# EAGLE design pcb (EAGLE 5.04)
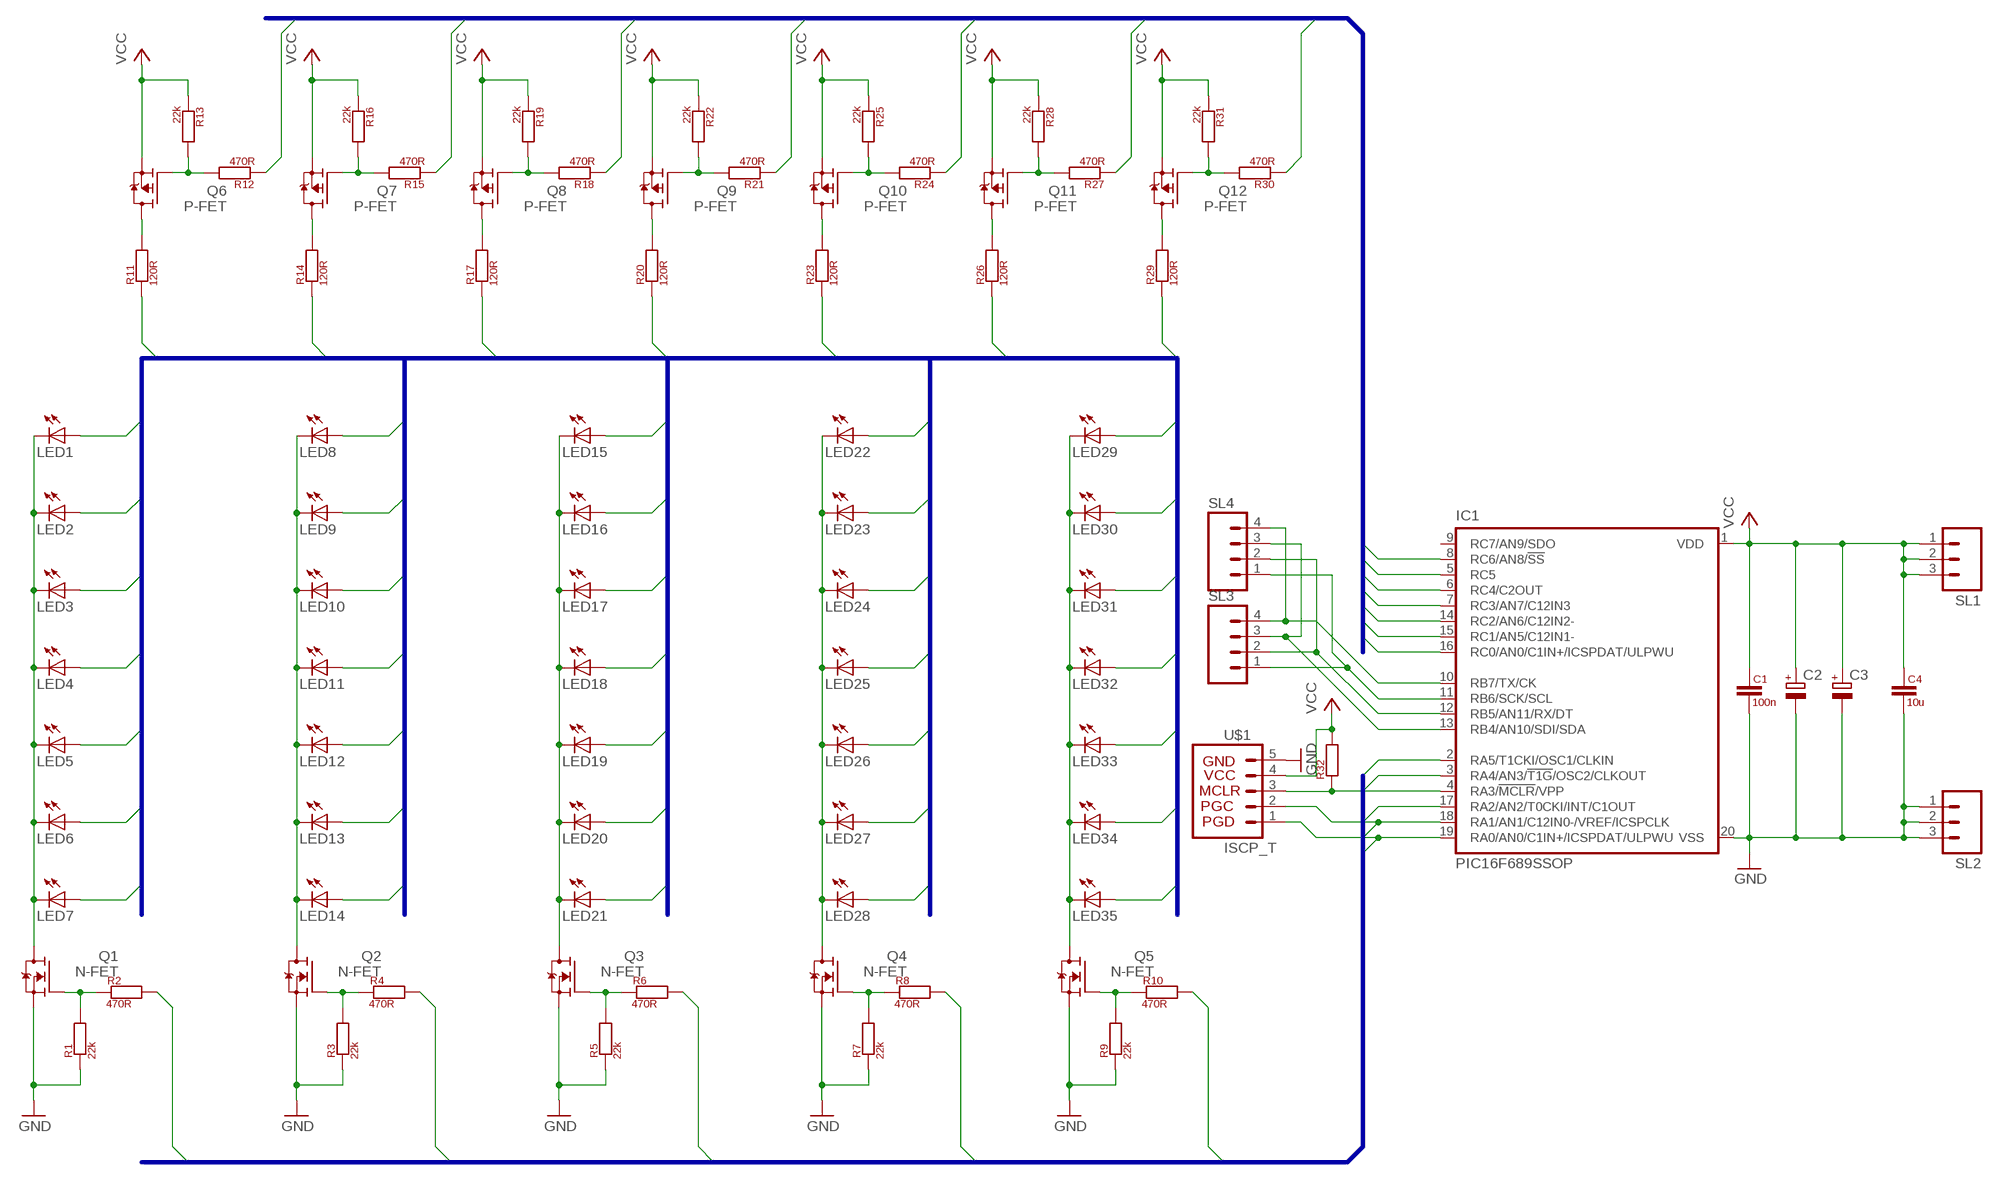
[diagram p0: schematic, sheet 1]

## Parts
C1  100n  CAP0805  [SMD_0805]
C2  CPOL-EUE2.5-7  [E2,5-7]
C3  CPOL-EUE2.5-7  [E2,5-7]
C4  10u  CAP0805  [SMD_0805]
IC1  PIC16F689SSOP  [SSOP20]
LED1  LED10MM  [LED10MM]
LED2  LED10MM  [LED10MM]
LED3  LED10MM  [LED10MM]
LED4  LED10MM  [LED10MM]
LED5  LED10MM  [LED10MM]
LED6  LED10MM  [LED10MM]
LED7  LED10MM  [LED10MM]
LED8  LED10MM  [LED10MM]
LED9  LED10MM  [LED10MM]
LED10  LED10MM  [LED10MM]
LED11  LED10MM  [LED10MM]
LED12  LED10MM  [LED10MM]
LED13  LED10MM  [LED10MM]
LED14  LED10MM  [LED10MM]
LED15  LED10MM  [LED10MM]
LED16  LED10MM  [LED10MM]
LED17  LED10MM  [LED10MM]
LED18  LED10MM  [LED10MM]
LED19  LED10MM  [LED10MM]
LED20  LED10MM  [LED10MM]
LED21  LED10MM  [LED10MM]
LED22  LED10MM  [LED10MM]
LED23  LED10MM  [LED10MM]
LED24  LED10MM  [LED10MM]
LED25  LED10MM  [LED10MM]
LED26  LED10MM  [LED10MM]
LED27  LED10MM  [LED10MM]
LED28  LED10MM  [LED10MM]
LED29  LED10MM  [LED10MM]
LED30  LED10MM  [LED10MM]
LED31  LED10MM  [LED10MM]
LED32  LED10MM  [LED10MM]
LED33  LED10MM  [LED10MM]
LED34  LED10MM  [LED10MM]
LED35  LED10MM  [LED10MM]
Q1  N-FET  IRLML2502VELIKIPADI  [SOT23]
Q2  N-FET  IRLML2502VELIKIPADI  [SOT23]
Q3  N-FET  IRLML2502VELIKIPADI  [SOT23]
Q4  N-FET  IRLML2502VELIKIPADI  [SOT23]
Q5  N-FET  IRLML2502VELIKIPADI  [SOT23]
Q6  P-FET  IRLML5203VELIKIPADI  [SOT23]
Q7  P-FET  IRLML5203VELIKIPADI  [SOT23]
Q8  P-FET  IRLML5203VELIKIPADI  [SOT23]
Q9  P-FET  IRLML5203VELIKIPADI  [SOT23]
Q10  P-FET  IRLML5203VELIKIPADI  [SOT23]
Q11  P-FET  IRLML5203VELIKIPADI  [SOT23]
Q12  P-FET  IRLML5203VELIKIPADI  [SOT23]
R1  22k  UPOR0805  [SMD_0805]
R2  470R  UPOR0805  [SMD_0805]
R3  22k  UPOR0805  [SMD_0805]
R4  470R  UPOR0805  [SMD_0805]
R5  22k  UPOR0805  [SMD_0805]
R6  470R  UPOR0805  [SMD_0805]
R7  22k  UPOR0805  [SMD_0805]
R8  470R  UPOR0805  [SMD_0805]
R9  22k  UPOR0805  [SMD_0805]
R10  470R  UPOR0805  [SMD_0805]
R11  120R  UPOR0805  [SMD_0805]
R12  470R  UPOR0805  [SMD_0805]
R13  22k  UPOR0805  [SMD_0805]
R14  120R  UPOR0805  [SMD_0805]
R15  470R  UPOR0805  [SMD_0805]
R16  22k  UPOR0805  [SMD_0805]
R17  120R  UPOR0805  [SMD_0805]
R18  470R  UPOR0805  [SMD_0805]
R19  22k  UPOR0805  [SMD_0805]
R20  120R  UPOR0805  [SMD_0805]
R21  470R  UPOR0805  [SMD_0805]
R22  22k  UPOR0805  [SMD_0805]
R23  120R  UPOR0805  [SMD_0805]
R24  470R  UPOR0805  [SMD_0805]
R25  22k  UPOR0805  [SMD_0805]
R26  120R  UPOR0805  [SMD_0805]
R27  470R  UPOR0805  [SMD_0805]
R28  22k  UPOR0805  [SMD_0805]
R29  120R  UPOR0805  [SMD_0805]
R30  470R  UPOR0805  [SMD_0805]
R31  22k  UPOR0805  [SMD_0805]
R32  UPOR0805  [SMD_0805]
SL1  M03  [03P]
SL2  M03  [03P]
SL3  M04  [04P]
SL4  M04  [04P]
U$1  ISCP_T  [ISCP_T]

## Nets
GND: C1.P$2 C2.- C3.- C4.P$2 IC1.20(VSS) Q1.2(S) Q2.2(S) Q3.2(S) Q4.2(S) Q5.2(S) R1.P$1 R3.P$1 R5.P$1 R7.P$1 R9.P$1 SL2.1 SL2.2 SL2.3 U$1.5
K1: IC1.19(RA0/AN0/C1IN+/ICSPDAT/ULPWU) R2.P$2 U$1.1
K2: IC1.18(RA1/AN1/C12IN0-/VREF/ICSPCLK) R4.P$2 U$1.2
K3: IC1.17(RA2/AN2/T0CKI/INT/C1OUT) R6.P$2
K4: IC1.3(RA4/AN3/!T1G!/OSC2/CLKOUT) R8.P$2
K5: IC1.2(RA5/T1CKI/OSC1/CLKIN) R10.P$2
LED1: LED1.A LED8.A LED15.A LED22.A LED29.A R11.P$1
LED2: LED2.A LED9.A LED16.A LED23.A LED30.A R14.P$1
LED3: LED3.A LED10.A LED17.A LED24.A LED31.A R17.P$1
LED4: LED4.A LED11.A LED18.A LED25.A LED32.A R20.P$1
LED5: LED5.A LED12.A LED19.A LED26.A LED33.A R23.P$1
LED6: LED6.A LED13.A LED20.A LED27.A LED34.A R26.P$1
LED7: LED7.A LED14.A LED21.A LED28.A LED35.A R29.P$1
N$1: LED1.K(C) LED2.K(C) LED3.K(C) LED4.K(C) LED5.K(C) LED6.K(C) LED7.K(C) Q1.3(D)
N$2: Q1.1(G) R1.P$2 R2.P$1
N$3: LED8.K(C) LED9.K(C) LED10.K(C) LED11.K(C) LED12.K(C) LED13.K(C) LED14.K(C) Q2.3(D)
N$4: Q2.1(G) R3.P$2 R4.P$1
N$5: LED15.K(C) LED16.K(C) LED17.K(C) LED18.K(C) LED19.K(C) LED20.K(C) LED21.K(C) Q3.3(D)
N$6: Q3.1(G) R5.P$2 R6.P$1
N$7: LED22.K(C) LED23.K(C) LED24.K(C) LED25.K(C) LED26.K(C) LED27.K(C) LED28.K(C) Q4.3(D)
N$8: Q4.1(G) R7.P$2 R8.P$1
N$9: LED29.K(C) LED30.K(C) LED31.K(C) LED32.K(C) LED33.K(C) LED34.K(C) LED35.K(C) Q5.3(D)
N$10: Q5.1(G) R9.P$2 R10.P$1
N$11: Q7.1(G) R15.P$2 R16.P$2
N$12: Q6.1(G) R12.P$2 R13.P$2
N$13: Q6.3(D) R11.P$2
N$14: Q7.3(D) R14.P$2
N$15: Q8.1(G) R18.P$2 R19.P$2
N$16: Q8.3(D) R17.P$2
N$17: Q9.1(G) R21.P$2 R22.P$2
N$18: Q9.3(D) R20.P$2
N$19: Q10.1(G) R24.P$2 R25.P$2
N$20: Q10.3(D) R23.P$2
N$21: Q11.1(G) R27.P$2 R28.P$2
N$22: Q11.3(D) R26.P$2
N$23: Q12.1(G) R30.P$2 R31.P$2
N$24: Q12.3(D) R29.P$2
N$25: IC1.10(RB7/TX/CK) SL3.4 SL4.4
N$26: IC1.4(RA3/!MCLR!/VPP) R32.P$1 U$1.3
N$27: IC1.11(RB6/SCK/SCL) SL3.1 SL4.1
N$28: IC1.12(RB5/AN11/RX/DT) SL3.2 SL4.2
N$29: IC1.13(RB4/AN10/SDI/SDA) SL3.3 SL4.3
RC0: IC1.16(RC0/AN0/C1IN+/ICSPDAT/ULPWU) R12.P$1
RC1: IC1.15(RC1/AN5/C12IN1-) R15.P$1
RC2: IC1.14(RC2/AN6/C12IN2-) R18.P$1
RC3: IC1.7(RC3/AN7/C12IN3) R21.P$1
RC4: IC1.6(RC4/C2OUT) R24.P$1
RC5: IC1.5(RC5) R27.P$1
RC6: IC1.8(RC6/AN8/!SS) R30.P$1
VCC: C1.P$1 C2.+ C3.+ C4.P$1 IC1.1(VDD) Q6.2(S) Q7.2(S) Q8.2(S) Q9.2(S) Q10.2(S) Q11.2(S) Q12.2(S) R13.P$1 R16.P$1 R19.P$1 R22.P$1 R25.P$1 R28.P$1 R31.P$1 R32.P$2 SL1.1 SL1.2 SL1.3 U$1.4
Unconnected: IC1.9(RC7/AN9/SDO)

## Buses
LED[1..7]
RC[0..6]
K[1..5]

## Library data of the parts
C1 C4 = ostali elementi:CAP0805
C2 C3 = resistor:CPOL-EU: POLARIZED CAPACITOR, European symbol
IC1 = microchip:PIC16F689
LED1-LED35 = led:LED: LED OSRAM: - CHIPLED LG R971, LG N971, LY N971, LG Q971, LY Q971, LO R971, LY R971 LH N974, LH R974 LS Q976, LO Q976, LY Q976 LO Q996 - Hyper CHIPLED LW Q18S LB Q993, LB Q99A, LB R99A - SideLED LS A670, LO A670, LY A670, LG A670, LP A670 LB A673, LV A673, LT A673, LW A673 LH A674 LY A675 LS A676, LA A676, LO A676, LY A676, LW A676 LS A679, LY A679, LG A679 - Hyper Micro SIDELED® LS Y876, LA Y876, LO Y876, LY Y876 LT Y87S - SmartLED LW L88C, LW L88S LB L89C, LB L89S, LG L890 LS L89K, LO L89K, LY L89K LS L896, LA L896, LO L896, LY L896 - TOPLED LS T670, LO T670, LY T670, LG T670, LP T670 LSG T670, LSP T670, LSY T670, LOP T670, LYG T670 LG T671, LOG T671, LSG T671 LB T673, LV T673, LT T673, LW T673 LH T674 LS T676, LA T676, LO T676, LY T676, LB T676, LH T676, LSB T676, LW T676 LB T67C, LV T67C, LT T67C, LS T67K, LO T67K, LY T67K, LW E67C LS E67B, LA E67B, LO E67B, LY E67B, LB E67C, LV E67C, LT E67C LW T67C LS T679, LY T679, LG T679 LS T770, LO T770, LY T770, LG T770, LP T770 LB T773, LV T773, LT T773, LW T773 LH T774 LS E675, LA E675, LY E675, LS T675 LS T776, LA T776, LO T776, LY T776, LB T776 LHGB T686 LT T68C, LB T68C - Hyper Mini TOPLED® LB M676 - Mini TOPLED Santana® LG M470 LS M47K, LO M47K, LY M47K Source: http://www.osram.convergy.de LUXEON: - LUMILED® LXK2-PW12-R00, LXK2-PW12-S00, LXK2-PW14-U00, LXK2-PW14-V00 LXK2-PM12-R00, LXK2-PM12-S00, LXK2-PM14-U00 LXK2-PE12-Q00, LXK2-PE12-R00, LXK2-PE12-S00, LXK2-PE14-T00, LXK2-PE14-U00 LXK2-PB12-K00, LXK2-PB12-L00, LXK2-PB12-M00, LXK2-PB14-N00, LXK2-PB14-P00, LXK2-PB14-Q00 LXK2-PR12-L00, LXK2-PR12-M00, LXK2-PR14-Q00, LXK2-PR14-R00 LXK2-PD12-Q00, LXK2-PD12-R00, LXK2-PD12-S00 LXK2-PH12-R00, LXK2-PH12-S00 LXK2-PL12-P00, LXK2-PL12-Q00, LXK2-PL12-R00 Source: www.luxeon.com KINGBRIGHT: KA-3528ASYC Source: www.kingbright.com
Q1-Q5 = ostali elementi:IRLML2502: HEXFET Power MOSFET - N-Channel MOSFET, Ultra Low On-Resistance Source: www.irf.com/product-info/datasheets/data/irlml2502pbf.pdf
Q6-Q12 = ostali elementi:IRLML5203: HEXFET Power MOSFET P-Channel, Ultra Low On-Resistance Source: www.irf.com/product-info/datasheets/data/irlml5203pbf.pdf
R1-R32 = ostali elementi:UPOR
SL1 SL2 = con-amp-quick:M03: AMP QUICK CONNECTOR
SL3 SL4 = con-amp-quick:M04: AMP QUICK CONNECTOR
U$1 = ostali elementi:ISCP_T

## Board
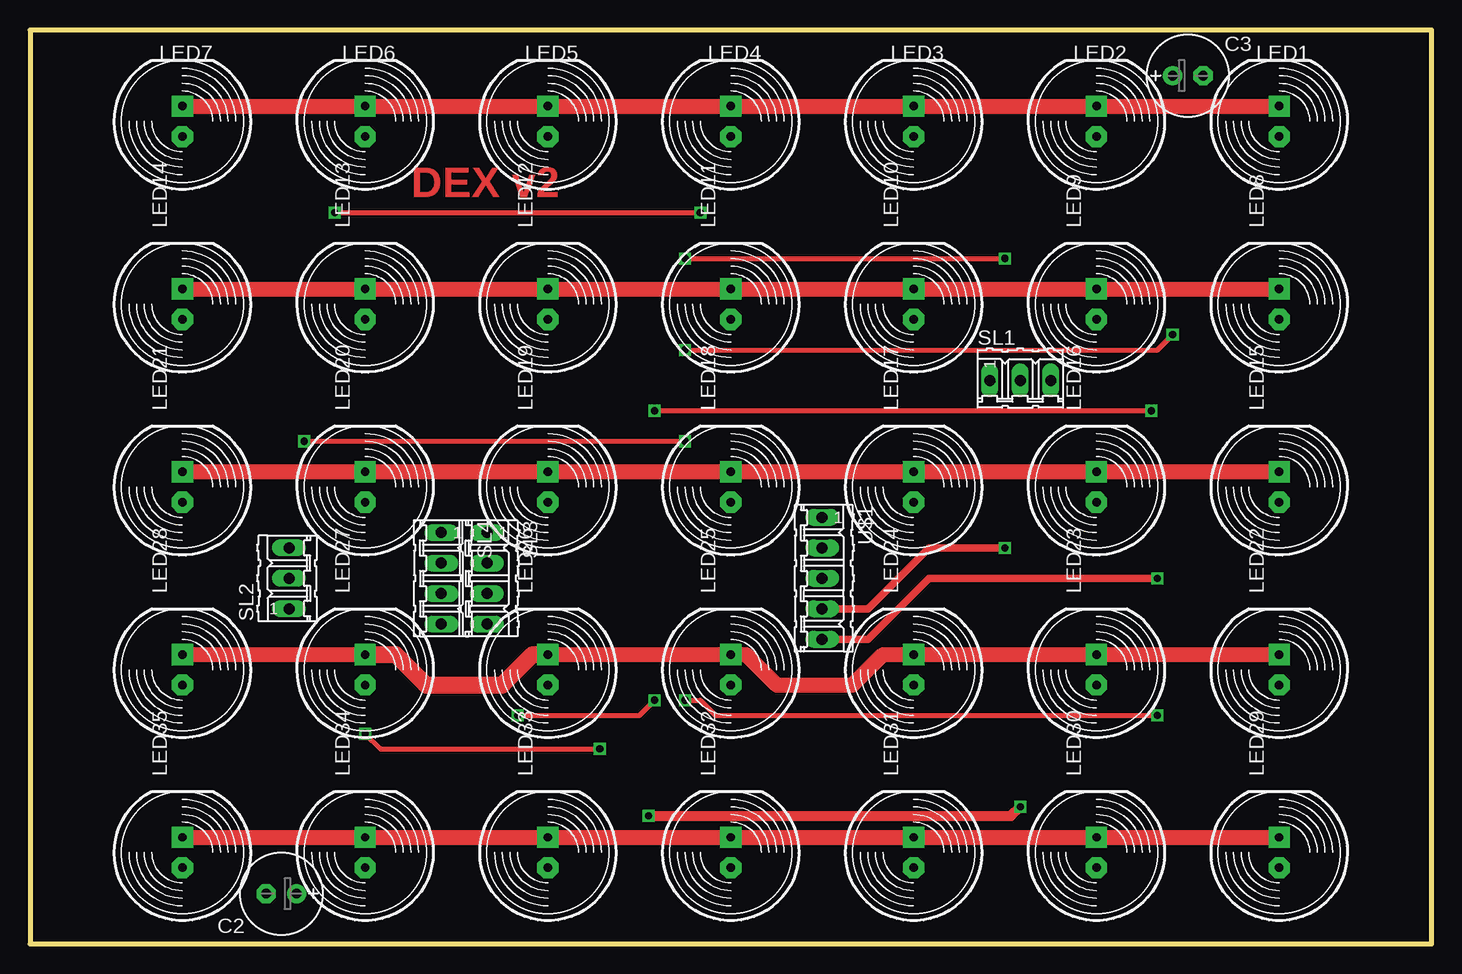
[diagram p1: board, top side]
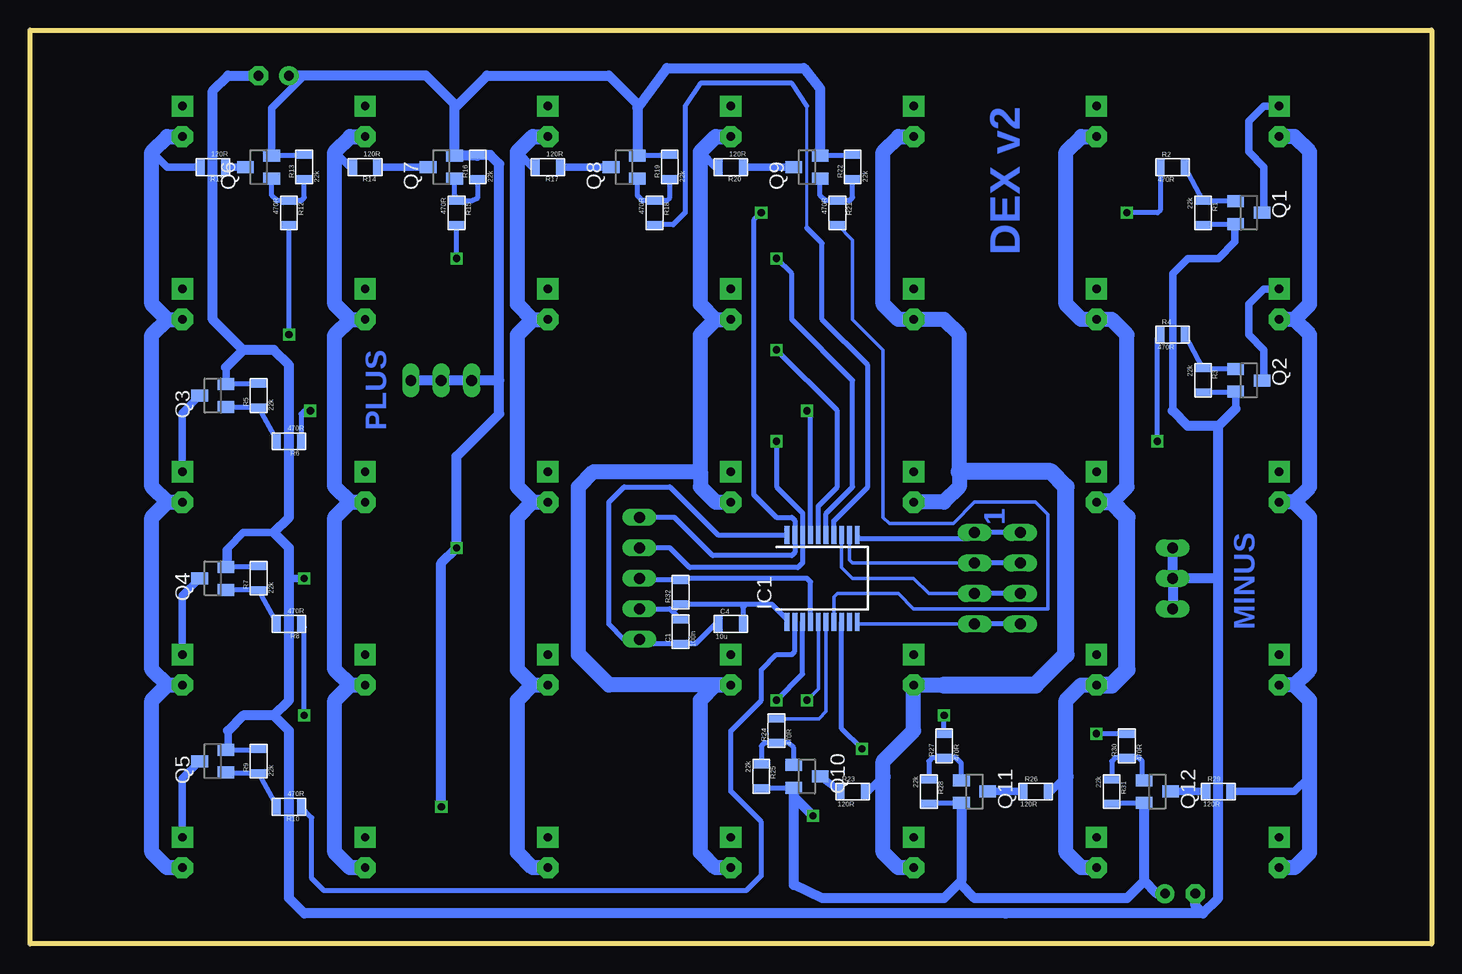
[diagram p2: board, bottom side, seen from below]

Size 116.84 x 76.2 mm. Coordinates in mm from the lower left corner, seen from the top.
Outline: 0,0 116.84,0 116.84,76.2 0,76.2 0,0
Copper layers (1*16): Top 0.035mm / dielectric 1.5mm / Bottom 0.035mm
Design rules "default *": minimum track width 10mil, minimum drill 15mil, track to track 8mil, track to pad 8mil, pad to pad 8mil, via to via 8mil, smd to smd 8mil, copper to edge 40mil, drill to drill 8mil, minimum pad ring 10mil, minimum via ring 8mil, stop-mask expansion 4mil, vias tented up to drill 0mil, thermal gap 10mil

### Footprints (pad centres in the part's own frame; a part is rotated, then mirrored left to right if it is on the bottom)
SMD_0805 = smd 1.27 x 0.635: P$1 0,1; P$2 0,-1
E2,5-7 = drill 0.813 pad 1.6 round: + -1.27,0 | drill 0.813 pad 1.6 octagon: - 1.27,0
SSOP20 = smd 0.4 x 1.5: 1 -2.925,-3.625; 2 -2.275,-3.625; 3 -1.625,-3.625; 4 -0.975,-3.625; 5 -0.325,-3.625; 6 0.325,-3.625; 7 0.975,-3.625; 8 1.625,-3.625; 9 2.275,-3.625; 10 2.925,-3.625; 11 2.925,3.625; 12 2.275,3.625; 13 1.625,3.625; 14 0.975,3.625; 15 0.325,3.625; 16 -0.325,3.625; 17 -0.975,3.625; 18 -1.625,3.625; 19 -2.275,3.625; 20 -2.925,3.625
LED10MM = drill 0.7 pad 1.778 octagon: A -1.27,0 | drill 0.7 pad 1.778 square: K 1.27,0
SOT23 = smd 1 x 1.4: 1 -0.95,-1.1; 2 0.95,-1.1; 3 0,1.1
03P = drill 0.914 long: 1 -2.54,0; 2 0,0; 3 2.54,0
04P = drill 0.914 long: 1 -3.81,0; 2 -1.27,0; 3 1.27,0; 4 3.81,0
ISCP_T = drill 0.914 long: 1 -5.08,0; 2 -2.54,0; 3 0,0; 4 2.54,0; 5 5.08,0

### Placement (x,y rotation side)
C1  62.61,26.03 0 bottom
C2  20.96,4.19 180 top
C3  96.52,72.39 0 top
C4  58.42,26.67 270 bottom
IC1  50.8,30.48 0 bottom
LED1  104.14,68.58 90 top
LED2  88.9,68.58 90 top
LED3  73.66,68.58 90 top
LED4  58.42,68.58 90 top
LED5  43.18,68.58 90 top
LED6  27.94,68.58 90 top
LED7  12.7,68.58 90 top
LED8  104.14,53.34 90 top
LED9  88.9,53.34 90 top
LED10  73.66,53.34 90 top
LED11  58.42,53.34 90 top
LED12  43.18,53.34 90 top
LED13  27.94,53.34 90 top
LED14  12.7,53.34 90 top
LED15  104.14,38.1 90 top
LED16  88.9,38.1 90 top
LED17  73.66,38.1 90 top
LED18  58.42,38.1 90 top
LED19  43.18,38.1 90 top
LED20  27.94,38.1 90 top
LED21  12.7,38.1 90 top
LED22  104.14,22.86 90 top
LED23  88.9,22.86 90 top
LED24  73.66,22.86 90 top
LED25  58.42,22.86 90 top
LED26  43.18,22.86 90 top
LED27  27.94,22.86 90 top
LED28  12.7,22.86 90 top
LED29  104.14,7.62 90 top
LED30  88.9,7.62 90 top
LED31  73.66,7.62 90 top
LED32  58.42,7.62 90 top
LED33  43.18,7.62 90 top
LED34  27.94,7.62 90 top
LED35  12.7,7.62 90 top
Q1  15.24,60.96 270 bottom
Q2  15.24,46.99 270 bottom
Q3  101.6,45.72 90 bottom
Q4  101.6,30.48 90 bottom
Q5  101.6,15.24 90 bottom
Q6  97.79,64.77 90 bottom
Q7  82.55,64.77 90 bottom
Q8  67.31,64.77 90 bottom
Q9  52.07,64.77 90 bottom
Q10  52.07,13.97 270 bottom
Q11  38.1,12.7 270 bottom
Q12  22.86,12.7 270 bottom
R1  19.05,60.96 180 bottom
R2  21.59,64.77 270 bottom
R3  19.05,46.99 180 bottom
R4  21.59,50.8 270 bottom
R5  97.79,45.72 0 bottom
R6  95.25,41.91 90 bottom
R7  97.79,30.48 0 bottom
R8  95.25,26.67 90 bottom
R9  97.79,15.24 0 bottom
R10  95.25,11.43 90 bottom
R11  101.6,64.77 90 bottom
R12  95.25,60.96 180 bottom
R13  93.98,64.77 0 bottom
R14  88.9,64.77 90 bottom
R15  81.28,60.96 180 bottom
R16  79.5,64.77 0 bottom
R17  73.66,64.77 90 bottom
R18  64.77,60.96 180 bottom
R19  63.5,64.77 0 bottom
R20  58.42,64.77 90 bottom
R21  49.53,60.96 180 bottom
R22  48.26,64.77 0 bottom
R23  48.26,12.7 270 bottom
R24  54.61,17.78 0 bottom
R25  55.88,13.97 180 bottom
R26  33.02,12.7 270 bottom
R27  40.64,16.51 0 bottom
R28  41.91,12.7 180 bottom
R29  17.78,12.7 270 bottom
R30  25.4,16.51 0 bottom
R31  26.67,12.7 180 bottom
R32  62.61,29.34 0 bottom
SL1  82.55,46.99 0 top
SL2  21.59,30.48 90 top
SL3  38.1,30.48 270 top
SL4  34.29,30.48 270 top
U$1  66.04,30.48 270 top

### Tracks (layer width: path | path; a pad name or v marks a point on that pad's centre or on a via)
GND  (via drill 0.6)
  Top 0.61: U$1.5 69.85,25.4 74.93,30.48 v93.98,30.48
  Bottom 0.406: Q5.2 97.84,16.19 R9.P$1 | R7.P$1 100.45,31.48 Q4.2 | R5.P$1 100.45,46.72 Q3.2 | R1.P$1 16.39,59.96 Q1.2 | R3.P$1 16.39,45.99 Q2.2 | IC1.20 59.51,34.1 63.5,38.1 67.31,38.1 68.58,36.83 68.58,26.67 67.31,25.4 U$1.5 65.68,25.04 C1.P$2 61.33,25.04 59.69,26.67 C4.P$2
  Bottom 0.61: 100.33,33.02 99.06,34.29 96.52,34.29 | 100.33,33.02 100.33,31.6 Q4.2 100.5,32.85 100.33,33.02 | 100.33,17.78 100.33,16.36 Q5.2 | 100.5,48.09 Q3.2 | 16.39,59.96 16.39,58.54 17.78,57.15 20.32,57.15 21.59,55.88 21.59,44.45 | 16.34,44.62 Q2.2 | 95.25,30.48 v93.98,30.48 | 35.56,2.54 35.43,2.41
  Bottom 0.813: 96.52,19.05 95.25,20.32 95.25,30.48 95.25,33.02 96.52,34.29 95.25,35.56 95.25,48.26 96.52,49.53 99.06,49.53 | 96.52,19.05 99.06,19.05 100.33,17.78 | 99.06,49.53 100.5,48.09 | 17.78,43.18 16.34,44.62 | 21.59,44.45 20.32,43.18 17.78,43.18 | 17.78,30.48 17.78,3.81 19.05,2.54 | 17.78,30.48 17.78,43.18 | 19.05,2.54 35.56,2.54 93.98,2.54 95.25,3.81 95.25,17.78 96.52,19.05 | C3.- 100.33,72.39 101.6,71.12 101.6,52.07 99.06,49.53 | C2.- 19.69,3.18 19.05,2.54 | SL2.2 SL2.1 | SL2.2 SL2.3 | 17.78,30.48 SL2.2
K1  (via drill 0.6)
  Top 0.406: v25.4,60.96 v55.88,60.96
  Bottom 0.406: U$1.1 63.12,35.56 59.94,32.38 53.34,32.38 53.08,32.65 IC1.19 53.08,35.3 53.34,35.56 54.61,35.56 56.52,37.46 56.52,60.32 v55.88,60.96 | v25.4,60.96 22.86,60.96 22.59,61.23 R2.P$2
K2  (via drill 0.6)
  Top 0.406: v22.86,41.91 v54.61,41.91
  Bottom 0.406: U$1.2 63.5,33.02 61.85,31.37 52.83,31.37 52.43,31.78 IC1.18 52.43,35.91 54.61,38.1 v54.61,41.91 | v22.86,41.91 22.86,50.53 R4.P$2
K3  (via drill 0.6)
  Top 0.406: v52.07,44.45 v93.47,44.45
  Bottom 0.406: IC1.17 51.78,44.16 v52.07,44.45 | R6.P$2 94.25,44.18 93.98,44.45 v93.47,44.45
K4  (via drill 0.6)
  Top 0.406: v54.61,20.32 55.88,20.32 57.15,19.05 v93.98,19.05
  Bottom 0.406: IC1.3 52.43,22.51 v54.61,20.32 | v93.98,19.05 93.98,26.4 R8.P$2
K5
  Bottom 0.406: R10.P$2 93.35,10.53 93.35,5.46 92.33,4.45 57.15,4.45 55.88,5.71 55.88,10.16 58.42,12.7 58.42,17.78 55.88,20.32 55.88,22.86 54.61,24.13 53.34,24.13 53.08,24.4 IC1.2
LED1
  Bottom 0.61: R11.P$1 105.41,64.77 106.68,66.04
  Bottom 1.27: LED1.A 105.41,67.31 106.68,66.04 106.68,53.34 105.41,52.07 | 105.41,52.07 LED8.A | 105.41,52.07 106.68,50.8 106.68,38.1 105.41,36.83 | 105.41,36.83 LED15.A | 105.41,36.83 106.68,35.56 106.68,22.86 105.41,21.59 | 105.41,21.59 LED22.A | 105.41,21.59 106.68,20.32 106.68,7.62 105.41,6.35 LED29.A
LED2
  Bottom 0.61: R14.P$1 90.17,64.77 91.44,66.04
  Bottom 1.27: LED30.A 90.17,6.35 91.44,7.62 91.44,20.32 90.17,21.59 | 90.17,21.59 LED23.A | 90.17,21.59 91.44,22.86 91.44,35.56 90.17,36.83 | 90.17,36.83 LED16.A | 90.17,36.83 91.44,38.1 91.44,50.8 90.17,52.07 | 90.17,52.07 LED9.A | 90.17,52.07 91.44,53.34 91.44,66.04 90.17,67.31 LED2.A
LED3
  Bottom 0.61: R17.P$1 74.93,64.77 76.2,66.04
  Bottom 1.27: 74.93,52.07 76.2,53.34 76.2,66.04 74.93,67.31 LED3.A | 74.93,52.07 LED10.A | 74.93,52.07 76.2,50.8 76.2,38.1 74.93,36.83 | 74.93,36.83 LED17.A | 74.93,36.83 76.2,35.56 76.2,22.86 74.93,21.59 | 74.93,21.59 LED24.A | 74.93,21.59 76.2,20.32 76.2,7.62 74.93,6.35 LED31.A
LED4
  Bottom 0.61: R20.P$1 59.69,64.77 60.96,66.04
  Bottom 1.27: LED32.A 59.69,6.35 60.96,7.62 60.96,20.32 59.69,21.59 LED25.A 68.58,21.59 71.12,24.13 71.12,38.1 69.85,39.37 60.96,39.37 | LED18.A 59.69,36.83 60.96,38.1 60.96,39.37 | 60.96,39.37 60.96,50.8 59.69,52.07 | 59.69,52.07 LED11.A | 59.69,52.07 60.96,53.34 60.96,66.04 59.69,67.31 LED4.A
LED5
  Bottom 0.61: R23.P$1 46.99,12.7 45.72,13.97
  Bottom 1.27: LED5.A 44.45,67.31 45.72,66.04 45.72,53.34 44.45,52.07 LED12.A 40.64,52.07 39.37,50.8 39.37,39.37 39.37,38.1 40.64,36.83 LED19.A | 40.64,21.59 LED26.A 43.18,17.78 45.72,15.24 45.72,13.97 45.72,7.62 44.45,6.35 LED33.A
  Bottom 1.422: 40.64,21.59 33.02,21.59 30.48,24.13 30.48,38.1 31.75,39.37 39.37,39.37
LED6
  Bottom 0.61: R26.P$1 31.75,12.7 30.48,13.97
  Bottom 1.27: LED34.A 29.21,6.35 30.48,7.62 30.48,13.97 30.48,20.32 29.21,21.59 LED27.A | LED6.A 29.21,67.31 30.48,66.04 30.48,53.34 29.21,52.07 LED13.A 26.67,52.07 25.4,50.8 25.4,38.1 26.67,36.83
  Bottom 1.422: LED20.A 26.67,36.83 25.4,35.56 25.4,22.86 26.67,21.59 LED27.A
LED7
  Bottom 0.61: R29.P$1 11.43,12.7 10.16,13.97
  Bottom 1.27: LED7.A 11.43,67.31 10.16,66.04 10.16,53.34 11.43,52.07 | 11.43,52.07 LED14.A | 11.43,52.07 10.16,50.8 10.16,38.1 11.43,36.83 | 11.43,36.83 LED21.A | 11.43,36.83 10.16,35.56 10.16,22.86 11.43,21.59 | 11.43,21.59 LED28.A | LED35.A 11.43,6.35 10.16,7.62 10.16,13.97 10.16,20.32 11.43,21.59
N$1
  Top 1.27: LED7.K LED6.K LED5.K LED4.K LED3.K LED2.K LED1.K
  Bottom 0.61: LED7.K 13.97,69.85 15.24,68.58 15.24,66.04 13.97,64.77 13.97,61.13 Q1.3
N$2
  Bottom 0.406: Q1.1 19,61.91 R1.P$2 R2.P$1
N$3
  Top 1.27: LED14.K LED13.K LED12.K LED11.K LED10.K LED9.K LED8.K
  Bottom 0.61: LED14.K 13.97,54.61 15.24,53.34 15.24,50.8 13.97,49.53 13.97,47.16 Q2.3
N$4
  Bottom 0.406: Q2.1 19,47.94 R3.P$2 R4.P$1
N$5
  Top 1.27: LED15.K LED16.K LED17.K LED18.K LED19.K LED20.K LED21.K
  Bottom 0.61: LED15.K 104.14,44.28 Q3.3
N$6
  Bottom 0.406: R6.P$1 R5.P$2 100.45,44.72 Q3.1
N$7
  Top 1.27: LED22.K LED23.K LED24.K 71.12,24.13 68.58,21.59 62.23,21.59 59.69,24.13 LED25.K LED26.K | LED28.K LED27.K
  Top 1.422: LED26.K 41.91,24.13 39.37,21.59 33.02,21.59 30.48,24.13 LED27.K
  Bottom 0.61: LED22.K 104.14,29.04 Q4.3
N$8
  Bottom 0.406: Q4.1 97.84,29.53 R7.P$2 R8.P$1
N$9
  Top 1.27: LED35.K LED34.K LED33.K LED32.K LED31.K LED30.K LED29.K
  Bottom 0.61: LED29.K 104.14,13.8 Q5.3
N$10
  Bottom 0.406: R10.P$1 R9.P$2 100.45,14.24 Q5.1
N$11
  Bottom 0.406: Q7.1 81.45,62.4 81.01,61.96 R15.P$2 80.03,61.96 79.5,62.23 R16.P$2
N$12
  Bottom 0.406: Q6.1 96.69,62.4 96.25,61.96 R12.P$2 94.25,61.96 93.98,62.23 R13.P$2
N$13
  Bottom 0.61: Q6.3 R11.P$2
N$14
  Bottom 0.61: Q7.3 R14.P$2
N$15
  Bottom 0.406: Q8.1 66.21,62.4 65.77,61.96 R18.P$2 63.77,61.96 63.5,62.23 R19.P$2
N$16
  Bottom 0.61: Q8.3 R17.P$2
N$17
  Bottom 0.406: Q9.1 50.97,62.4 50.53,61.96 R21.P$2 48.53,61.96 48.26,62.23 R22.P$2
N$18
  Bottom 0.61: Q9.3 R20.P$2
N$19
  Bottom 0.406: Q10.1 53.17,16.34 53.61,16.78 R24.P$2 55.61,16.78 55.88,16.51 R25.P$2
N$20
  Bottom 0.61: R23.P$2 Q10.3
N$21
  Bottom 0.406: Q11.1 39.2,15.07 39.64,15.51 R27.P$2 41.64,15.51 41.91,15.24 R28.P$2
N$22
  Bottom 0.61: R26.P$2 Q11.3
N$23
  Bottom 0.406: Q12.1 24.13,13.82 24.13,15.24 24.4,15.51 R30.P$2 26.4,15.51 26.67,15.24 R31.P$2
N$24
  Bottom 0.61: R29.P$2 Q12.3
N$25
  Bottom 0.305: SL3.4 47.69,26.67 IC1.10
  Bottom 0.406: SL4.4 SL3.4
N$26
  Bottom 0.406: IC1.4 51.78,30.18 52.07,30.48 62.47,30.48 R32.P$1 65.9,30.34 U$1.3
N$27
  Bottom 0.305: 47.55,33.78 IC1.11
  Bottom 0.406: SL4.1 SL3.1 38.61,33.78 47.55,33.78
N$28
  Bottom 0.305: IC1.12 48.53,32.02 48.26,31.75 SL3.2
  Bottom 0.406: SL4.2 SL3.2
N$29
  Bottom 0.305: SL3.3 41.91,29.21 43.18,30.48 48.26,30.48 49.18,31.39 IC1.13
  Bottom 0.406: SL4.3 SL3.3
RC0  (via drill 0.6)
  Top 0.406: v54.61,49.53 93.98,49.53 v95.25,50.8
  Bottom 0.406: v95.25,50.8 R12.P$1 | v54.61,49.53 49.53,44.45 49.53,38.1 51.13,36.5 IC1.16
RC1  (via drill 0.6)
  Top 0.406: v54.61,57.15 v81.28,57.15
  Bottom 0.406: v54.61,57.15 53.34,55.88 53.34,52.07 48.26,46.99 48.26,38.1 50.48,35.88 IC1.15 | v81.28,57.15 R15.P$1
RC2
  Bottom 0.254: 52.07,59.69 52.07,69.85
  Bottom 0.406: IC1.14 49.83,35.27 46.99,38.1 46.99,48.26 50.8,52.07 50.8,58.42 52.07,59.69 | 52.07,69.85 53.34,71.76 60.96,71.76 62.23,69.85 62.23,60.96 63.23,59.96 R18.P$1
RC3
  Bottom 0.305: IC1.7 49.83,28.91 49.53,29.21 44.45,29.21 43.18,27.94 32,27.94 32,35.81 33.02,36.83 38.1,36.83 39.88,35.05 45.21,35.05 45.72,35.56 45.72,49.53 48.26,52.07 48.26,58.69 R21.P$1
RC4
  Bottom 0.305: R24.P$1 51.07,18.78 50.48,19.38 IC1.6
RC5  (via drill 0.6)
  Top 0.406: v52.07,20.32 50.8,19.05 v40.64,19.05
  Bottom 0.305: IC1.5 51.13,21.27 v52.07,20.32
  Bottom 0.406: R27.P$1 v40.64,19.05
RC6  (via drill 0.6)
  Top 0.406: v47.5,16.26 29.21,16.26 v27.94,17.53
  Bottom 0.406: IC1.8 49.18,17.93 v47.5,16.26 | v27.94,17.53 25.42,17.53 R30.P$1
VCC  (via drill 0.6)
  Top 0.61: U$1.4 69.85,27.94 74.93,33.02 v81.28,33.02
  Top 0.813: v51.56,10.67 81.79,10.67 v82.55,11.43
  Bottom 0.406: R22.P$1 50.92,65.77 Q9.2 | R13.P$1 96.64,65.77 Q6.2 | Q7.2 81.4,65.77 | R19.P$1 66.16,65.77 Q8.2 | R31.P$1 24.01,11.7 Q12.2 | R28.P$1 39.25,11.7 Q11.2 | R25.P$1 53.22,12.97 Q10.2 | 63.5,27.94 63.01,27.94 R32.P$2 57.15,28.34 | U$1.4 63.5,27.94 | IC1.1 53.73,27.05 55.01,28.34 57.15,28.34 | C1.P$1 62.61,27.05 63.5,27.94 | C4.P$1 57.42,28.07 57.15,28.34
  Bottom 0.61: Q8.2 66.21,69.68 | Q7.2 81.45,69.68 | Q6.2 96.69,69.68 93.98,72.39 | 39.2,4.91 Q11.2 | R16.P$1 79.55,65.72 | Q10.2 53.17,12.28 | 35.56,3.81 35.43,3.94
  Bottom 0.813: Q9.2 50.97,71.29 52.32,73.03 63.75,73.03 66.21,69.68 | Q8.2 66.21,70.02 68.58,72.39 78.74,72.39 81.45,69.68 | 23.96,5.25 Q12.2 | 23.96,5.25 25.4,3.81 35.56,3.81 38.1,3.81 39.2,4.91 | Q11.2 39.2,5.25 40.64,3.81 50.8,3.81 53.17,4.91 Q10.2 | 77.72,46.99 77.72,44.2 81.28,40.64 v81.28,33.02 82.55,31.75 v82.55,11.43 | 77.72,46.99 77.72,65.02 78.47,65.77 R16.P$1 | 79.55,65.72 Q7.2 81.45,70.02 83.82,72.39 93.98,72.39 C3.+ | 53.17,12.28 v51.56,10.67 | C2.+ 22.9,4.19 23.96,5.25 | SL1.3 SL1.2 SL1.1 77.72,46.99

### Text on the board
Top: DEX v2
Bottom: DEX v2 | PLUS | MINUS | 1